# EAGLE design zeta2_v2 (EAGLE 9.0.1)
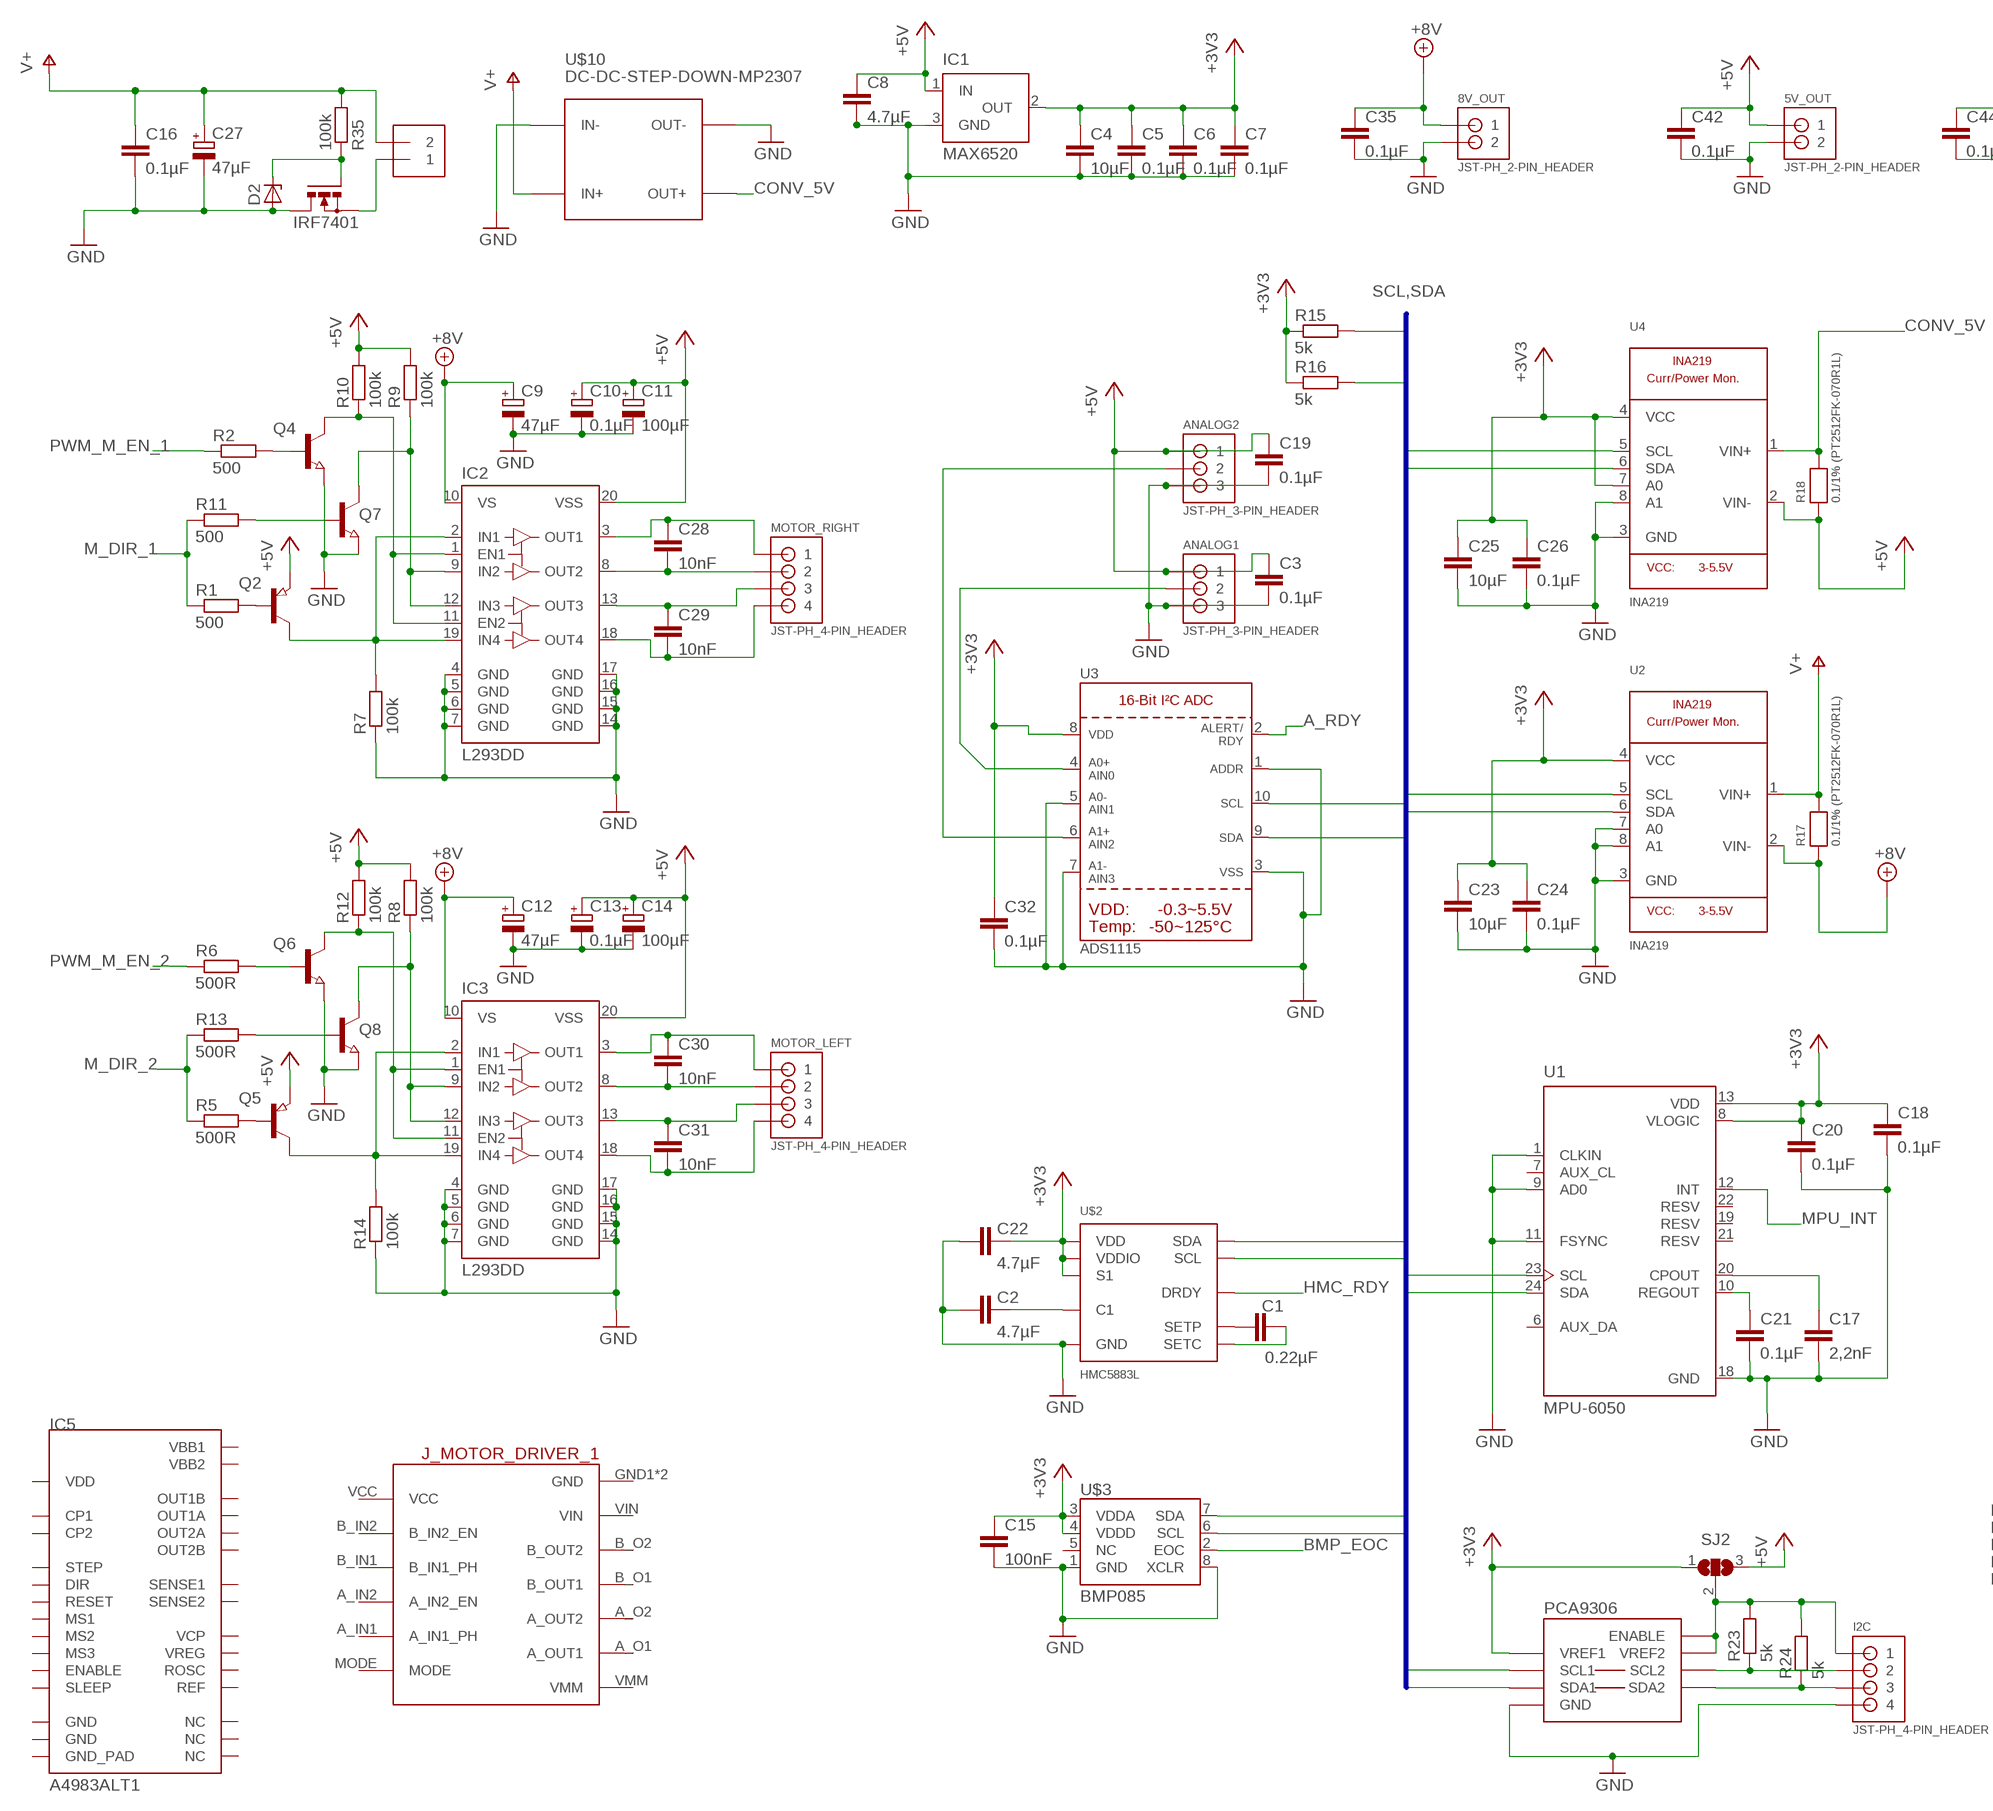
[diagram p0: schematic, sheet 1, part 1 of 2]
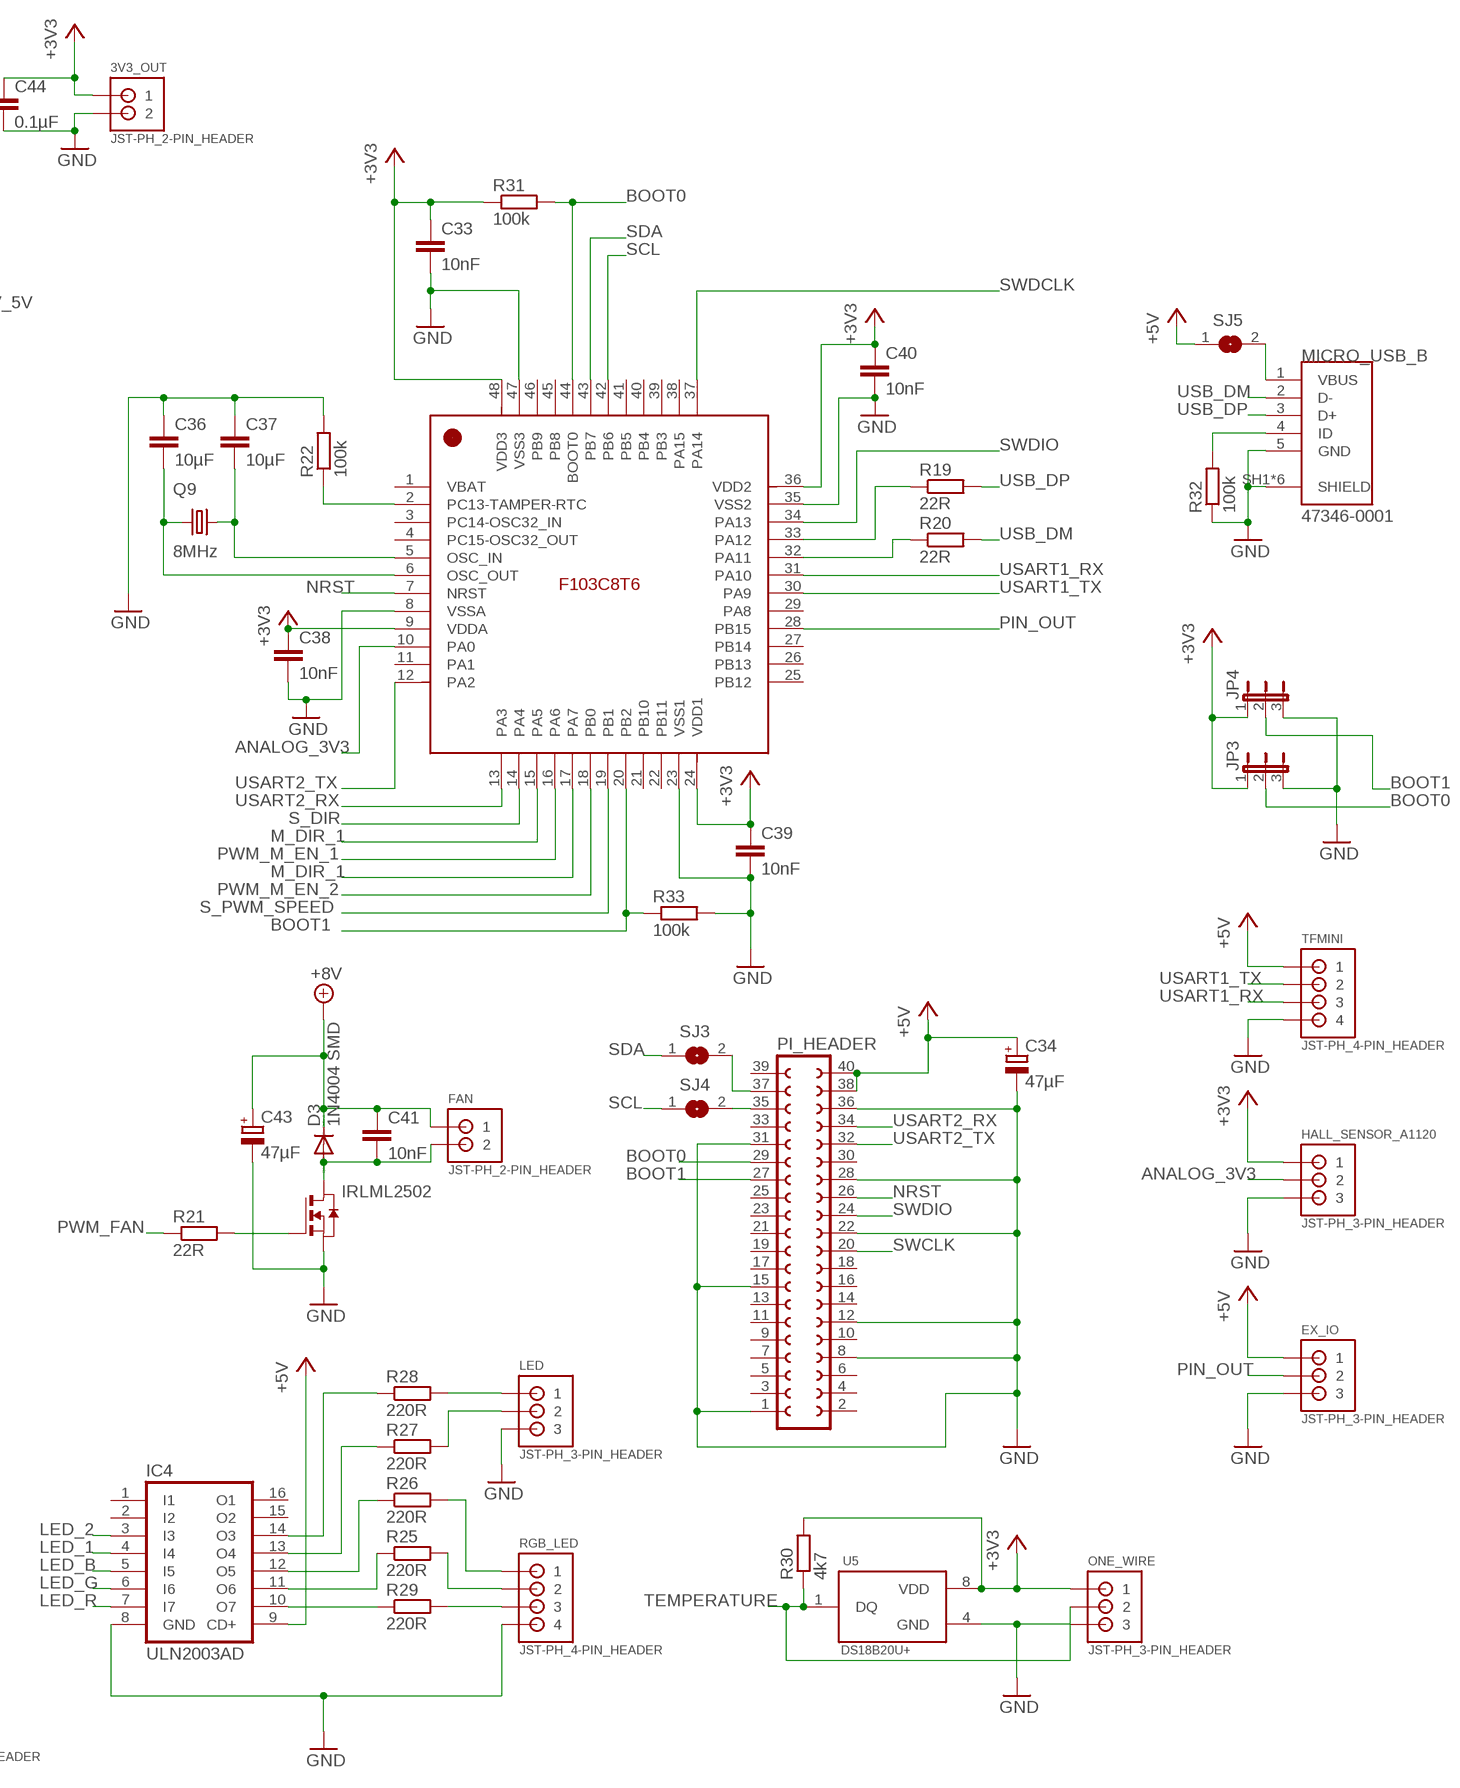
[diagram p1: schematic, sheet 1, part 2 of 2]

## Parts
3V3_OUT  JST-PH_2-PIN_HEADER  [JST_B2B-PH_HEADER]
5V_OUT  JST-PH_2-PIN_HEADER  [JST_B2B-PH_HEADER]
8V_OUT  JST-PH_2-PIN_HEADER  [JST_B2B-PH_HEADER]
ANALOG1  JST-PH_3-PIN_HEADER  [JST_B3B-PH_HEADER]
ANALOG2  JST-PH_3-PIN_HEADER  [JST_B3B-PH_HEADER]
C1  0.22µF  C-EUC0603  [C0603]
C2  4.7µF  C-EUC0603  [C0603]
C3  0.1µF  C-EUC0603  [C0603]
C4  10µF  C-EUC0603  [C0603]
C5  0.1µF  C-EUC0603  [C0603]
C6  0.1µF  C-EUC0603  [C0603]
C7  0.1µF  C-EUC0603  [C0603]
C8  4.7µF  C-EUC0603  [C0603]
C9  47µF  CPOL-EUSMCC  [SMC_C]
C10  0.1µF  CPOL-EUSMCA  [SMC_A]
C11  100µF  CPOL-EUSMCC  [SMC_C]
C12  47µF  CPOL-EUSMCC  [SMC_C]
C13  0.1µF  CPOL-EUSMCA  [SMC_A]
C14  100µF  CPOL-EUSMCC  [SMC_C]
C15  100nF  C-EUC0603  [C0603]
C16  0.1µF  C-EUC0603  [C0603]
C17  2,2nF  C-EUC0603  [C0603]
C18  0.1µF  C-EUC0603  [C0603]
C19  0.1µF  C-EUC0603  [C0603]
C20  0.1µF  C-EUC0603  [C0603]
C21  0.1µF  C-EUC0603  [C0603]
C22  4.7µF  C-EUC0603  [C0603]
C23  10µF  C-EUC0603  [C0603]
C24  0.1µF  C-EUC0603  [C0603]
C25  10µF  C-EUC0603  [C0603]
C26  0.1µF  C-EUC0603  [C0603]
C27  47µF  CPOL-EUSMCC  [SMC_C]
C28  10nF  C-EUC0603  [C0603]
C29  10nF  C-EUC0603  [C0603]
C30  10nF  C-EUC0603  [C0603]
C31  10nF  C-EUC0603  [C0603]
C32  0.1µF  C-EUC0603  [C0603]
C33  10nF  C-EUC0603  [C0603]
C34  47µF  CPOL-EUSMCC  [SMC_C]
C35  0.1µF  C-EUC0603  [C0603]
C36  10µF  C-EUC0603  [C0603]
C37  10µF  C-EUC0603  [C0603]
C38  10nF  C-EUC0603  [C0603]
C39  10nF  C-EUC0603  [C0603]
C40  10nF  C-EUC0603  [C0603]
C41  10nF  C-EUC0603  [C0603]
C42  0.1µF  C-EUC0603  [C0603]
C43  47µF  CPOL-EUSMCC  [SMC_C]
C44  0.1µF  C-EUC0603  [C0603]
D2  ZENER-DIODESOD80C  [SOD80C]
D3  1N4004 SMD  DIODE-MELF-MLL41  [MELF-MLL41]
EX_IO  JST-PH_3-PIN_HEADER  [JST_B3B-PH_HEADER]
FAN  JST-PH_2-PIN_HEADER  [JST_B2B-PH_HEADER]
HALL_SENSOR_A1120  JST-PH_3-PIN_HEADER  [JST_B3B-PH_HEADER]
I2C  JST-PH_4-PIN_HEADER  [JST_B4B-PH_HEADER]
IC1  MAX6520  [SOT23]
IC2  L293DD  [SO20]
IC3  L293DD  [SO20]
IC4  ULN2003AD  [SO16]
IC5  A4983ALT1  [QFN-28-5MM_ALT1]
IRF7401  N-MOSFET-SO8S  [SO-08]
IRLML2502  NMOSSOT23  [SOT-23]
J_MOTOR_DRIVER_1  MOTOR_DRIVER  [MOTOR_DRIVER_FOOTPRINT]
JP3  JP2E  [JP2]
JP4  JP2E  [JP2]
LED  JST-PH_3-PIN_HEADER  [JST_B3B-PH_HEADER]
MICRO_USB_B  47346-0001  [MOLEX_47346-0001]
MOTOR_LEFT  JST-PH_4-PIN_HEADER  [JST_B4B-PH_HEADER]
MOTOR_RIGHT  JST-PH_4-PIN_HEADER  [JST_B4B-PH_HEADER]
ONE_WIRE  JST-PH_3-PIN_HEADER  [JST_B3B-PH_HEADER]
PCA9306  IC2_LEVEL_TRANSLATER  [SOIC-8]
PI_HEADER  FE20-2  [FE20-2]
Q2  PNP-TRANSISTOR_SOT23  [SOT23]
Q4  NPN-TRANSISTOR_SOT23  [SOT23]
Q5  PNP-TRANSISTOR_SOT23  [SOT23]
Q6  NPN-TRANSISTOR_SOT23  [SOT23]
Q7  NPN-TRANSISTOR_SOT23  [SOT23]
Q8  NPN-TRANSISTOR_SOT23  [SOT23]
Q9  8MHz  KX-13  [7.0X5.0]
R1  500  R-EU_R0603  [R0603]
R2  500  R-EU_R0603  [R0603]
R5  500R  R-EU_R0603  [R0603]
R6  500R  R-EU_R0603  [R0603]
R7  100k  R-EU_R0603  [R0603]
R8  100k  R-EU_R0603  [R0603]
R9  100k  R-EU_R0603  [R0603]
R10  100k  R-EU_R0603  [R0603]
R11  500  R-EU_R0603  [R0603]
R12  100k  R-EU_R0603  [R0603]
R13  500R  R-EU_R0603  [R0603]
R14  100k  R-EU_R0603  [R0603]
R15  5k  R-EU_R0603  [R0603]
R16  5k  R-EU_R0603  [R0603]
R17  0.1/1% (PT2512FK-070R1L)  RESISTOR2512  [2512]
R18  0.1/1% (PT2512FK-070R1L)  RESISTOR2512  [2512]
R19  22R  R-EU_R0603  [R0603]
R20  22R  R-EU_R0603  [R0603]
R21  22R  R-EU_R0603  [R0603]
R22  100k  R-EU_R0603  [R0603]
R23  5k  R-EU_R0603  [R0603]
R24  5k  R-EU_R0603  [R0603]
R25  220R  R-EU_R0603  [R0603]
R26  220R  R-EU_R0603  [R0603]
R27  220R  R-EU_R0603  [R0603]
R28  220R  R-EU_R0603  [R0603]
R29  220R  R-EU_R0603  [R0603]
R30  4k7  R-EU_R0603  [R0603]
R31  100k  R-EU_R0603  [R0603]
R32  100k  R-EU_R0603  [R0603]
R33  100k  R-EU_R0603  [R0603]
R35  100k  R-EU_R0603  [R0603]
RGB_LED  JST-PH_4-PIN_HEADER  [JST_B4B-PH_HEADER]
SJ2  SJ2W  [SJ_2]
SJ3  SOLDERJUMPERREFLOW_NOPASTE  [SOLDERJUMPER_REFLOW_NOPASTE]
SJ4  SOLDERJUMPERREFLOW_NOPASTE  [SOLDERJUMPER_REFLOW_NOPASTE]
SJ5  SOLDERJUMPERREFLOW_NOPASTE  [SOLDERJUMPER_REFLOW_NOPASTE]
SUPPLY_IN  TERMBLOCK_1X2-3.5MM  [1X2-3.5MM]
TFMINI  JST-PH_4-PIN_HEADER  [JST_B4B-PH_HEADER]
U1  MPU-6050  [QFN50P400X400X95-24N]
U2  INA219  [SOT23-8]
U3  ADS1115  [MSOP10]
U4  INA219  [SOT23-8]
U5  DS18B20U+  [SOP65P490X95-8N]
U$1  STM32F103C8T6  [LQFP48_7X7MM_0.5MMPP]
U$2  HMC5883L  [LPCC-16]
U$3  BMP085  [BMP085]
U$10  DC-DC-STEP-DOWN-MP2307  [DC-DC-STEP-DOWN-MP2307]

## Nets
+3V3: 3V3_OUT.P1 C4.1 C5.1 C6.1 C7.1 C15.1 C18.1 C20.1 C22.1 C23.1 C24.1 C25.1 C26.1 C32.1 C33.1 C38.1 C39.1 C40.1 C44.1 HALL_SENSOR_A1120.P1 IC1.2(OUT) JP3.1 JP4.1 ONE_WIRE.P1 PCA9306.1(VREF1) R15.1 R16.1 R30.2 R31.1 SJ2.1 U1.8(VLOGIC) U1.13(VDD) U2.4(VCC) U3.8(VDD) U4.4(VCC) U4.7(A0) U5.8(VDD) U$1.9(VDDA) U$1.24(VDD1) U$1.36(VDD2) U$1.48(VDD3) U$2.2(VDD) U$2.4(S1) U$2.13(VDDIO) U$3.3(VDDA) U$3.4(VDDD)
+5V: 5V_OUT.P1 ANALOG1.P1 ANALOG2.P1 C3.1 C8.1 C10.+ C11.+ C13.+ C14.+ C19.1 C34.+ C42.1 EX_IO.P1 IC1.1(IN) IC2.20(VSS) IC3.20(VSS) IC4.9(CD+) PI_HEADER.38 PI_HEADER.40 Q2.2(E) Q5.2(E) R8.2 R9.2 R10.2 R12.2 R18.1 SJ2.3 SJ5.1 TFMINI.P1 U4.2(VIN-)
+8V: 8V_OUT.P1 C9.+ C12.+ C35.1 C41.1 C43.+ D3.C FAN.P1 IC2.10(VS) IC3.10(VS) R17.1 U2.2(VIN-)
A_RDY: U3.2(ALERT/RDY)
ANALOG_3V3: HALL_SENSOR_A1120.P2 U$1.10(PA0)
BMP_EOC: U$3.2(EOC)
BOOT0: JP3.2 PI_HEADER.29 R31.2 U$1.44(BOOT0)
BOOT1: JP4.2 PI_HEADER.27 R33.1 U$1.20(PB2)
CONV_5V: R18.2 U4.1(VIN+) U$10.OUT+
GND: 3V3_OUT.P2 5V_OUT.P2 8V_OUT.P2 ANALOG1.P3 ANALOG2.P3 C2.2 C3.2 C4.2 C5.2 C6.2 C7.2 C8.2 C9.- C10.- C11.- C12.- C13.- C14.- C15.2 C16.2 C17.2 C18.2 C19.2 C20.2 C21.2 C22.2 C23.2 C24.2 C25.2 C26.2 C27.- C32.2 C33.2 C34.- C35.2 C36.1 C37.1 C38.2 C39.2 C40.2 C42.2 C43.- C44.2 D2.A EX_IO.P3 HALL_SENSOR_A1120.P3 I2C.P4 IC1.3(GND) IC2.4(GND) IC2.5(GND) IC2.6(GND) IC2.7(GND) IC2.14(GND) IC2.15(GND) IC2.16(GND) IC2.17(GND) IC3.4(GND) IC3.5(GND) IC3.6(GND) IC3.7(GND) IC3.14(GND) IC3.15(GND) IC3.16(GND) IC3.17(GND) IC4.8(GND) IRF7401.5(D) IRF7401.6(D) IRF7401.7(D) IRF7401.8(D) IRLML2502.2(S) JP3.3 JP4.3 LED.P3 MICRO_USB_B.5(GND) MICRO_USB_B.SH1(SHIELD) MICRO_USB_B.SH2(SHIELD) MICRO_USB_B.SH3(SHIELD) MICRO_USB_B.SH4(SHIELD) MICRO_USB_B.SH5(SHIELD) MICRO_USB_B.SH6(SHIELD) ONE_WIRE.P3 PCA9306.4(GND) PI_HEADER.1 PI_HEADER.8 PI_HEADER.12 PI_HEADER.15 PI_HEADER.22 PI_HEADER.28 PI_HEADER.31 PI_HEADER.36 Q4.2(E) Q6.2(E) Q7.2(E) Q8.2(E) R7.1 R14.1 R22.2 R32.1 R33.2 RGB_LED.P4 TFMINI.P4 U1.1(CLKIN) U1.9(AD0) U1.11(FSYNC) U1.18(GND) U2.3(GND) U2.7(A0) U2.8(A1) U3.1(ADDR) U3.3(VSS) U3.5(AIN1) U3.7(AIN3) U4.3(GND) U4.8(A1) U5.4(GND) U$1.8(VSSA) U$1.23(VSS1) U$1.35(VSS2) U$1.47(VSS3) U$2.9(GND) U$2.11(GND) U$3.1(GND) U$3.8(XCLR) U$10.IN- U$10.OUT-
HMC_RDY: U$2.15(DRDY)
LED_1: IC4.4(I4)
LED_2: IC4.3(I3)
LED_B: IC4.5(I5)
LED_G: IC4.6(I6)
LED_R: IC4.7(I7)
M_DIR_1: R1.1 R11.1 U$1.15(PA5) U$1.17(PA7)
M_DIR_2: R5.1 R13.1
MPU_INT: U1.12(INT)
N$1: IC2.9(IN2) IC2.12(IN3) Q7.3(C) R9.1
N$2: C1.2 U$2.12(SETC)
N$3: C1.1 U$2.8(SETP)
N$4: C2.1 U$2.10(C1)
N$5: IC2.2(IN1) IC2.19(IN4) Q2.3(C) R7.2
N$6: IC3.9(IN2) IC3.12(IN3) Q8.3(C) R8.1
N$7: IC3.2(IN1) IC3.19(IN4) Q5.3(C) R14.2
N$8: IC2.1(EN1) IC2.11(EN2) Q4.3(C) R10.1
N$9: IC3.1(EN1) IC3.11(EN2) Q6.3(C) R12.1
N$10: Q2.1(B) R1.2
N$11: Q7.1(B) R11.2
N$12: Q4.1(B) R2.2
N$13: Q5.1(B) R5.2
N$14: Q6.1(B) R6.2
N$15: Q8.1(B) R13.2
N$16: C17.1 U1.20(CPOUT)
N$17: C29.1 IC2.13(OUT3) MOTOR_RIGHT.P3
N$18: C29.2 IC2.18(OUT4) MOTOR_RIGHT.P4
N$19: C21.1 U1.10(REGOUT)
N$20: C28.2 IC2.8(OUT2) MOTOR_RIGHT.P2
N$21: C28.1 IC2.3(OUT1) MOTOR_RIGHT.P1
N$23: C31.1 IC3.13(OUT3) MOTOR_LEFT.P3
N$24: C31.2 IC3.18(OUT4) MOTOR_LEFT.P4
N$25: C30.2 IC3.8(OUT2) MOTOR_LEFT.P2
N$26: C30.1 IC3.3(OUT1) MOTOR_LEFT.P1
N$27: IC4.10(O7) R29.1
N$28: C36.2 Q9.1 U$1.6(OSC_OUT)
N$29: C37.2 Q9.3 U$1.5(OSC_IN)
N$30: IRLML2502.3(G) R21.2
N$31: IC4.11(O6) R25.1
N$32: R20.1 U$1.32(PA11)
N$33: R19.1 U$1.33(PA12)
N$34: R22.1 U$1.2(PC13-TAMPER-RTC)
N$35: PI_HEADER.37 SJ3.2
N$36: PI_HEADER.35 SJ4.2
N$37: IC4.12(O5) R26.1
N$38: I2C.P1 PCA9306.7(VREF2) PCA9306.8(ENABLE) R23.2 R24.2 SJ2.2
N$39: I2C.P2 PCA9306.6(SCL2) R23.1
N$40: I2C.P3 PCA9306.5(SDA2) R24.1
N$41: IC4.13(O4) R27.1
N$42: IC4.14(O3) R28.1
N$43: MICRO_USB_B.4(ID) R32.2
N$44: LED.P1 R28.2
N$45: R29.2 RGB_LED.P3
N$46: R25.2 RGB_LED.P2
N$47: R26.2 RGB_LED.P1
N$48: LED.P2 R27.2
N$49: MICRO_USB_B.1(VBUS) SJ5.2
N$50: ANALOG1.P2 U3.4(AIN0)
N$51: ANALOG2.P2 U3.6(AIN2)
N$55: C41.2 D3.A FAN.P2 IRLML2502.1(D)
N$56: D2.C IRF7401.4(G) R35.1
N$60: IRF7401.1(S) IRF7401.2(S) IRF7401.3(S) SUPPLY_IN.1
NRST: PI_HEADER.26 U$1.7(NRST)
PIN_OUT: EX_IO.P2 U$1.28(PB15)
PWM_FAN: R21.1
PWM_M_EN_1: R2.1 U$1.16(PA6)
PWM_M_EN_2: R6.1 U$1.18(PB0)
S_DIR: U$1.14(PA4)
S_PWM_SPEED: U$1.19(PB1)
SCL: PCA9306.2(SCL1) R15.2 SJ4.1 U1.23(SCL) U2.5(SCL) U3.10(SCL) U4.5(SCL) U$1.42(PB6) U$2.1(SCL) U$3.6(SCL)
SDA: PCA9306.3(SDA1) R16.2 SJ3.1 U1.24(SDA) U2.6(SDA) U3.9(SDA) U4.6(SDA) U$1.43(PB7) U$2.16(SDA) U$3.7(SDA)
SWCLK: PI_HEADER.20
SWDCLK: U$1.37(PA14)
SWDIO: PI_HEADER.24 U$1.34(PA13)
TEMPERATURE: ONE_WIRE.P2 R30.1 U5.1(DQ)
USART1_RX: TFMINI.P3 U$1.31(PA10)
USART1_TX: TFMINI.P2 U$1.30(PA9)
USART2_RX: PI_HEADER.34 U$1.13(PA3)
USART2_TX: PI_HEADER.32 U$1.12(PA2)
USB_DM: MICRO_USB_B.2(D-) R20.2
USB_DP: MICRO_USB_B.3(D+) R19.2
V+: C16.1 C27.+ R17.2 R35.2 SUPPLY_IN.2 U2.1(VIN+) U$10.IN+
Unconnected: IC4.1(I1) IC4.2(I2) IC4.15(O2) IC4.16(O1) IC5.P$1(OUT2B) IC5.P$2(ENABLE) IC5.P$4(CP1) IC5.P$5(CP2) IC5.P$6(VCP) IC5.P$7(NC) IC5.P$8(VREG) IC5.P$9(MS1) IC5.P$10(MS2) IC5.P$11(MS3) IC5.P$12(RESET) IC5.P$13(ROSC) IC5.P$14(SLEEP) IC5.P$16(STEP) IC5.P$17(REF) IC5.P$19(DIR) IC5.P$20(NC) IC5.P$21(OUT1B) IC5.P$22(VBB1) IC5.P$23(SENSE1) IC5.P$24(OUT1A) IC5.P$25(NC) IC5.P$26(OUT2A) IC5.P$27(SENSE2) IC5.P$28(VBB2) J_MOTOR_DRIVER_1.A_IN1(A_IN1_PH) J_MOTOR_DRIVER_1.A_IN2(A_IN2_EN) J_MOTOR_DRIVER_1.A_O1(A_OUT1) J_MOTOR_DRIVER_1.A_O2(A_OUT2) J_MOTOR_DRIVER_1.B_IN1(B_IN1_PH) J_MOTOR_DRIVER_1.B_IN2(B_IN2_EN) J_MOTOR_DRIVER_1.B_O1(B_OUT1) J_MOTOR_DRIVER_1.B_O2(B_OUT2) J_MOTOR_DRIVER_1.GND1(GND) J_MOTOR_DRIVER_1.GND2(GND) J_MOTOR_DRIVER_1.MODE J_MOTOR_DRIVER_1.VCC J_MOTOR_DRIVER_1.VIN J_MOTOR_DRIVER_1.VMM PI_HEADER.2 PI_HEADER.3 PI_HEADER.4 PI_HEADER.5 PI_HEADER.6 PI_HEADER.7 PI_HEADER.9 PI_HEADER.10 PI_HEADER.11 PI_HEADER.13 PI_HEADER.14 PI_HEADER.16 PI_HEADER.17 PI_HEADER.18 PI_HEADER.19 PI_HEADER.21 PI_HEADER.23 PI_HEADER.25 PI_HEADER.30 PI_HEADER.33 PI_HEADER.39 U1.6(AUX_DA) U1.7(AUX_CL) U1.19(RESV) U1.21(RESV) U1.22(RESV) U$1.1(VBAT) U$1.3(PC14-OSC32_IN) U$1.4(PC15-OSC32_OUT) U$1.11(PA1) U$1.21(PB10) U$1.22(PB11) U$1.25(PB12) U$1.26(PB13) U$1.27(PB14) U$1.29(PA8) U$1.38(PA15) U$1.39(PB3) U$1.40(PB4) U$1.41(PB5) U$1.45(PB8) U$1.46(PB9) U$3.5(NC)

## Buses
SCL,SDA

## Power pins joined to a net without a drawn wire
GND: IC5.P$3(GND) IC5.P$18(GND)
GND_PAD: IC5.P$29(GND_PAD)
VDD: IC5.P$15(VDD)

## Library data of the parts
3V3_OUT 5V_OUT 8V_OUT FAN = srg:JST-PH_2-PIN_HEADER: 2-pin JST PH Shrouded Header, top entry P/N B2B-PH-K-S Mating connector PHR-2 Mating cable assembly: Sparkfun PRT-09914 <http://www.sparkfun.com/products/9914>
ANALOG1 ANALOG2 EX_IO HALL_SENSOR_A1120 LED ONE_WIRE = srg:JST-PH_3-PIN_HEADER: 3-pin JST PH Shrouded Header, top entry P/N B3B-PH-K-S Mating connector PHR-3
C1-C8 C15-C26 C28-C33 C35-C42 C44 = rcl:C-EU: CAPACITOR, European symbol; SPICEPREFIX: C
C9-C14 C27 C34 C43 = rcl:CPOL-EU: POLARIZED CAPACITOR, European symbol; SPICEPREFIX: C
D2 = diode:ZENER-DIODE: Z-Diode
D3 = diode:DIODE-: DIODE
I2C MOTOR_LEFT MOTOR_RIGHT RGB_LED TFMINI = srg:JST-PH_4-PIN_HEADER: 4-pin JST PH Shrouded Header, top entry P/N B4B-PH-K-S Mating connector PHR-4 Mating cable assembly: Sparkfun PRT-09916 <http://www.sparkfun.com/products/9916>
IC1 = maxim:MAX6520: 1.2V Voltage Reference 50ppm/°C, SOT23, 3-Terminal Source: Data sheet <http://datasheets.maxim-ic.com/en/ds/MAX6520.pdf>; MF: MAXIM; MPN: MAX6520EUR-T; OC_FARNELL: unknown; OC_NEWARK: 02J4586
IC2 IC3 = st-microelectronics:L293DD: PUSH-PULL FOUR CHANNEL DRIVER WITH DIODES Source: http://www.st.com/stonline/books/pdf/docs/1330.pdf; OC_FARNELL: unknown
IC4 = uln-udn:ULN2003A: DRIVER ARRAY
IC5 = Testing:A4983: DMOS Microstepping Driver with Translator
IRF7401 = transistor-power:N-MOSFET-SO8: N-Channel MOSFET Example: FDS7760A; N-Channel Logic Level PowerTrench® MOSFET FDS2572; N-Channel UltraFET® Trench MOSFET Source: www.fairchildsemi.com
IRLML2502 = zetex:NMOSSOT23: MOS FET; OC_FARNELL: unknown; OC_NEWARK: unknown
J_MOTOR_DRIVER_1 = Pololu Encoder and Motor Driver:MOTOR_DRIVER: DRV8835 Dual Motor Driver Carrier
JP3 JP4 = jumper:JP2E: JUMPER
MICRO_USB_B = 47346-0001:47346-0001: CONN RCPT 5POS MICRO USB R/A SMD; AVAILABILITY: Good; DESCRIPTION: Micro-USB B Receptacle with Flange, Bottom Mount, SMT, Lead-Free; MF: Molex; MP: 47346-0001; PACKAGE: None; PRICE: 0.70 USD
PCA9306 = srg:IC2_LEVEL_TRANSLATER: I2C Level Translator PCA9306 Data Sheet <http://www.ti.com/lit/ds/symlink/pca9306.pdf> Sparkfun breakout board schematic <http://dlnmh9ip6v2uc.cloudfront.net/datasheets/BreakoutBoards/PCA9306_Breakout.pdf>
PI_HEADER = con-lsta:FE20-2: FEMALE HEADER; OC_FARNELL: unknown; OC_NEWARK: unknown
Q2 Q5 = semicon-smd-ipc:PNP-TRANSISTOR_: PNP TRANSISTOR
Q4 Q6-Q8 = semicon-smd-ipc:NPN-TRANSISTOR_: NPN TRANSISTOR
Q9 = crystal-geyer_V1_0:KX: Quartz Crystals (MHz) SMD: KX - Serie Model Size l/w/h [mm] Frequency Range Frequency Stability Temp. Range [°C] Load Capacitance AECQ 200 availabel Datasheet KX-4 KX-5 KX-6 KX-7 KX-9A KX-9B KX-12A KX-12B KX-13 KX-20 KX-K KX-KS 1.6/1.2/0.3 2.0/1.6/0.45 2.5/2.0/0.55 3.2/2.5/0.8 5.0/3.2/1.0 5.0/3.2/1.1 6.0/3.5/1.1 6.0/3.5/1.0 7.0/5.0 /1.3 11.6/5.5/1.6 12.3/4.5/4.2 12.3/4.5/3.2 24.0 ~ 80.0 MHz 16.0 ~ 80.0 MHz 12.0 ~ 80.0 MHz 8.0 ~ 60.0 MHz 7,68 ~ 300,0 MHz 8,0 ~ 50,0 MHz 8,0 ~ 150,0 MHz 8,0 ~ 50,0 MHz 6,0 ~ 160,0 MHz 3,579 ~ 25,0 MHz 3,579 ~ 70,0 MHz 3,579 ~ 70,0 MHz ±10 … ±50ppm ±10 … ±50ppm ±10 … ±50ppm ±10 … ±50ppm ±10 … ±50ppm ±10 … ±50ppm ±10 … ±50ppm ±10 … ±50ppm ±10 … ±50ppm ±50ppm ±10 … ±50ppm ±10 … ±50ppm (*) -40°C …+85°C (*) -40°C …+125°C (*) -40°C …+125°C (*) -40°C …+125°C (*) -40°C …+105°C (*) -40°C …+105°C (*) -40°C …+125°C (*) -40°C …+105°C (*) -40°C …+105°C (*) -40°C …+105°C (*) -40°C …+85°C (*) -40°C …+85°C 8, 8…16 8, 8…16 10, 8…16 12, 7…20 16, 10…20 16, 10…20 16, 10…20 16, 12…20 16, 12…20 16, 12…20 16, 12…30 16, 12…30 - yes yes yes - - - - - - - - KX-4.pdf <http://www.geyer-electronic.de/uploads/tx_userartikelfrequenz/GEYER-KX-4.pdf> KX-5.pdf <http://www.geyer-electronic.de/uploads/tx_userartikelfrequenz/GEYER-KX-5.pdf> KX-6.pdf <http://www.geyer-electronic.de/uploads/tx_userartikelfrequenz/GEYER-KX-6.pdf> KX-7.pdf <http://www.geyer-electronic.de/uploads/tx_userartikelfrequenz/GEYER-KX-7.pdf> KX-9A.pdf <http://www.geyer-electronic.de/uploads/tx_userartikelfrequenz/GEYER-KX-9A.pdf> KX-9B.pdf <http://www.geyer-electronic.de/uploads/tx_userartikelfrequenz/GEYER-KX-9B.pdf> KX-12A.pdf <http://www.geyer-electronic.de/uploads/tx_userartikelfrequenz/GEYER-KX-12A.pdf> KX-12B.pdf <http://www.geyer-electronic.de/uploads/tx_userartikelfrequenz/GEYER-KX-12B.pdf> KX-13.pdf <http://www.geyer-electronic.de/uploads/tx_userartikelfrequenz/GEYER-KX-13.pdf> KX-20.pdf <http://www.geyer-electronic.de/uploads/tx_userartikelfrequenz/GEYER-KX-20.pdf> KX-K.pdf <http://www.geyer-electronic.de/uploads/tx_userartikelfrequenz/GEYER-KX-K.pdf> KX-KS.pdf <http://www.geyer-electronic.de/uploads/tx_userartikelfrequenz/GEYER-KX-KS.pdf> <http://www.geyer-electronic.de/fileadmin/template/img/logo-geyer-electronic.png> Details see: http://www.geyer-electronic.de/Frequenz-Produkte.9.0.html Created 2016-06-07, Hans Locher 2016 (C) Geyer Quartz Technology KX4,KX5,KX6,KX7,KX9A,KX9B,KX12A,KX12B,KX13,KX20,KXK,KXKS;1612;2016;2520;3225;5032;6035;7050;11655;12345;1,6x1,2;2,0x1,6;2,5x2,0;3,2x2,5;5,0x3,2;6,0x3,5;7,0x5,0;11,6x5,5;12,3x4,5;12,3x4,5;1.6x1.2;2.0x1.6;2.5x2.0;3.2x2.5;5.0x3.2;6.0x3.5;7.0x5.0;11.6x5.5;12.3x4.5;12.3x4.5;
R1 R2 R5-R16 R19-R33 R35 = rcl:R-EU_: RESISTOR, European symbol; SPICEPREFIX: R
R17 R18 = microbuilder:RESISTOR: Resistors 0402 - 0402 Surface Mount Package 22 Ohm 1% 1/16W [Digikey: 311-22.0LRTR-ND] 33 Ohm 5% 1/16W 1.0K 5% 1/16W 1.5K 5% 1/16W 2.0K 1% 1/16W 10.0K 1% 1/16W [Digikey: 311-10.0KLRTR-ND] 10.0K 5% 1/16W [Digikey: RMCF0402JT10K0TR-ND] 12.1K 1% 1/16W [Digikey: 311-22.0LRTR-ND] 100.0K 5% 1/16W 0603 - 0603 Surface Mount Package 0 Ohm 1/10 Watt 1% Resistor 15 Ohm 1/10 Watt 1% Resistor 33 Ohm 1/10 Watt 1% Resistor 49.9 Ohm 1/10 Watt 1% Resistor 100 Ohm 1/10 Watt 1% Resistor 150 Ohm 1/10 Watt 1% Resistor 240 Ohm 1/10 Watt 1% Resistor 390 Ohm 1/10 Watt 1% Resistor 560 Ohm 1/10 Watt 1% Resistor 680 Ohm 1/10 Watt 1% Resistor 750 Ohm 1/10 Watt 1% Resistor 1.0K Ohm 1/10 Watt 1% Resistor 1.5K Ohm 1/10 Watt 1% Resistor 2.0K Ohm 1/10 Watt 1% Resistor 2.2K Ohm 1/10 Watt 1% Resistor 3.3K Ohm 1/10 Watt 1% Resistor 4.7K Ohm 1/10 Watt 1% Resistor 10.0K Ohm 1/10 Watt 1% Resistor 12.0K Ohm 1/10 Watt 1% Resistor 12.1K Ohm 1/10 Watt 1% Resistor 20.0K Ohm 1/10 Watt 1% Resistor 33.0K Ohm 1/10 Watt 1% Resistor 100.0K Ohm 1/10 Watt 1% Resistor 0805 - 0805 Surface Mount Package 0 Ohm 1/8 Watt 1% Resistor 33 Ohm 1/8 Watt 1% Resistor 100 Ohm 1/8 Watt 1% Resistor 150 Ohm 1/8 Watt 1% Resistor 200 Ohm 1/8 Watt 1% Resistor 240 Ohm 1/8 Watt 1% Resistor 330 Ohm 1/8 Watt 1% Resistor 390 Ohm 1/8 Watt 1% Resistor 470 Ohm 1/8 Watt 1% Resistor 1.0K Ohm 1/8 Watt 1% Resistor 1.5K Ohm 1/8 Watt 1% Resistor 2.0K Ohm 1/8 Watt 1% Resistor 4.7K Ohm 1/8 Watt 1% Resistor 5.1K Ohm 1/8 Watt 1% Resistor 5.6K Ohm 1/8 Watt 1% Resistor 10.0K Ohm 1/8 Watt 1% Resistor 22.0K Ohm 1/8 Watt 1% Resistor 33.0K Ohm 1/8 Watt 1% Resistor 100K Ohm 1/8 Watt 1% Resistor 1206 - 1206 Surface Mount Package 2012 - 2010 Surface Mount Package 0.11 Ohm 1/2 Watt 1% Resistor - Digikey: RHM.11UCT-ND
SJ2 = jumper:SJ2W: SMD solder JUMPER
SJ3-SJ5 = microbuilder:SOLDERJUMPER: SMD Solder JUMPER Solder the two pads together to create a connection, or remove the solder to break it. REFLOW - Use this footprint for solder paste and reflow ovens. WAVE - Use this footprint for hand-soldering (larger pads). CLOSED - Has a trace between the two pads to ensure it is closed by default. The trace needs to be cut to disable the jumper, and can be closed again by creating a solder bridge between the two pads.
SUPPLY_IN = microbuilder:TERMBLOCK_1X2: 3.5mm Terminal block http://www.ladyada.net/library/pcb/eaglelibrary.html
U1 = MPU-6050:MPU-6050: MPU-6050 Six-Axis (Gyro + Accelerometer) MEMS MotionTracking™ Devices; AVAILABILITY: Good; DESCRIPTION: 3-axis gyroscope, 3-axis accelerometer in a 4x4x0.9 housing; MF: TDK; MP: MPU-6050; PACKAGE: QFN-24 InvenSense; PRICE: 5.12 USD
U2 U4 = INA219:INA219: INA219 - I2C Current/Power Monitor Voltage Range: 0-26V Accuracy: 0.5% Temperature: -40°C - 125°C; AVAILABILITY: Unavailable; DESCRIPTION: the ina219 is a high-side current shunt and power monitor with an i2c interface. the ina219 monitors both shunt drop ...; MF: Texas Instruments; MP: INA219; PACKAGE: None; PRICE: None
U3 = ADS1115:ADS1115: 16-Bit Del-Sig ADC Four single-ended inputs or two differential inputs Internal PGA I2C interface 2.0-5.5V; AVAILABILITY: Unavailable; DESCRIPTION: 16-Bit ADC with Integrated MUX PGA Comparator Oscillator and Reference; MF: Texas Instruments; MP: ADS1115; PACKAGE: XFQFN-10 Texas Instruments; PRICE: None
U5 = DS18B20U_:DS18B20U+: Board Mount Temperature Sensors Prgmble Resolution 1-Wire Parasite Pwr; AVAILABILITY: Unavailable; DESCRIPTION: Date Code: 1043+; RoHS Compliant: Yes;; MF: Maxim; MP: DS18B20U+; PACKAGE: TSSOP-8 Chip Coolers; PRICE: None
U$1 = STM32F103C8T6:STM32F103C8T6; AVAILABILITY: Good; DESCRIPTION: Mainstream Performance line, ARM Cortex-M3 MCU with 64 Kbytes Flash, 72 MHz CPU, motor control, USB and CAN; MF: STMicroelectronics; MP: STM32F103C8T6; PACKAGE: LQFP-48 STMicroelectronics; PRICE: 3.83 USD
U$2 = HMC5883L:HMC5883L; AVAILABILITY: Unavailable; DESCRIPTION: Digital Compass +/- 0.8g, Lcc-16; MF: Honeywell; MP: HMC5883L-T; PACKAGE: LCC-16 Honeywell; PRICE: None
U$3 = BMP085:BMP085: BMP085 Pressure Sensor Great little MEMS pressure sensor. SKU: COM-09603; AVAILABILITY: Unavailable; MF: Bosch Sensortec; MP: BMP085; PACKAGE: CLCC-8 Bosch Sensortec; PRICE: None
U$10 = diy-modules:DC-DC-STEP-DOWN-MP2307: DC/DC Step-Down Regulator based on MP2307DN chip MP2307 datasheet available here: https://cdn-shop.adafruit.com/datasheets/MP2307_r1.9.pdf Click here to find device on ebay.com <http://www.ebay.com/sch/dc+dc+3a+mini+converter>

## Board
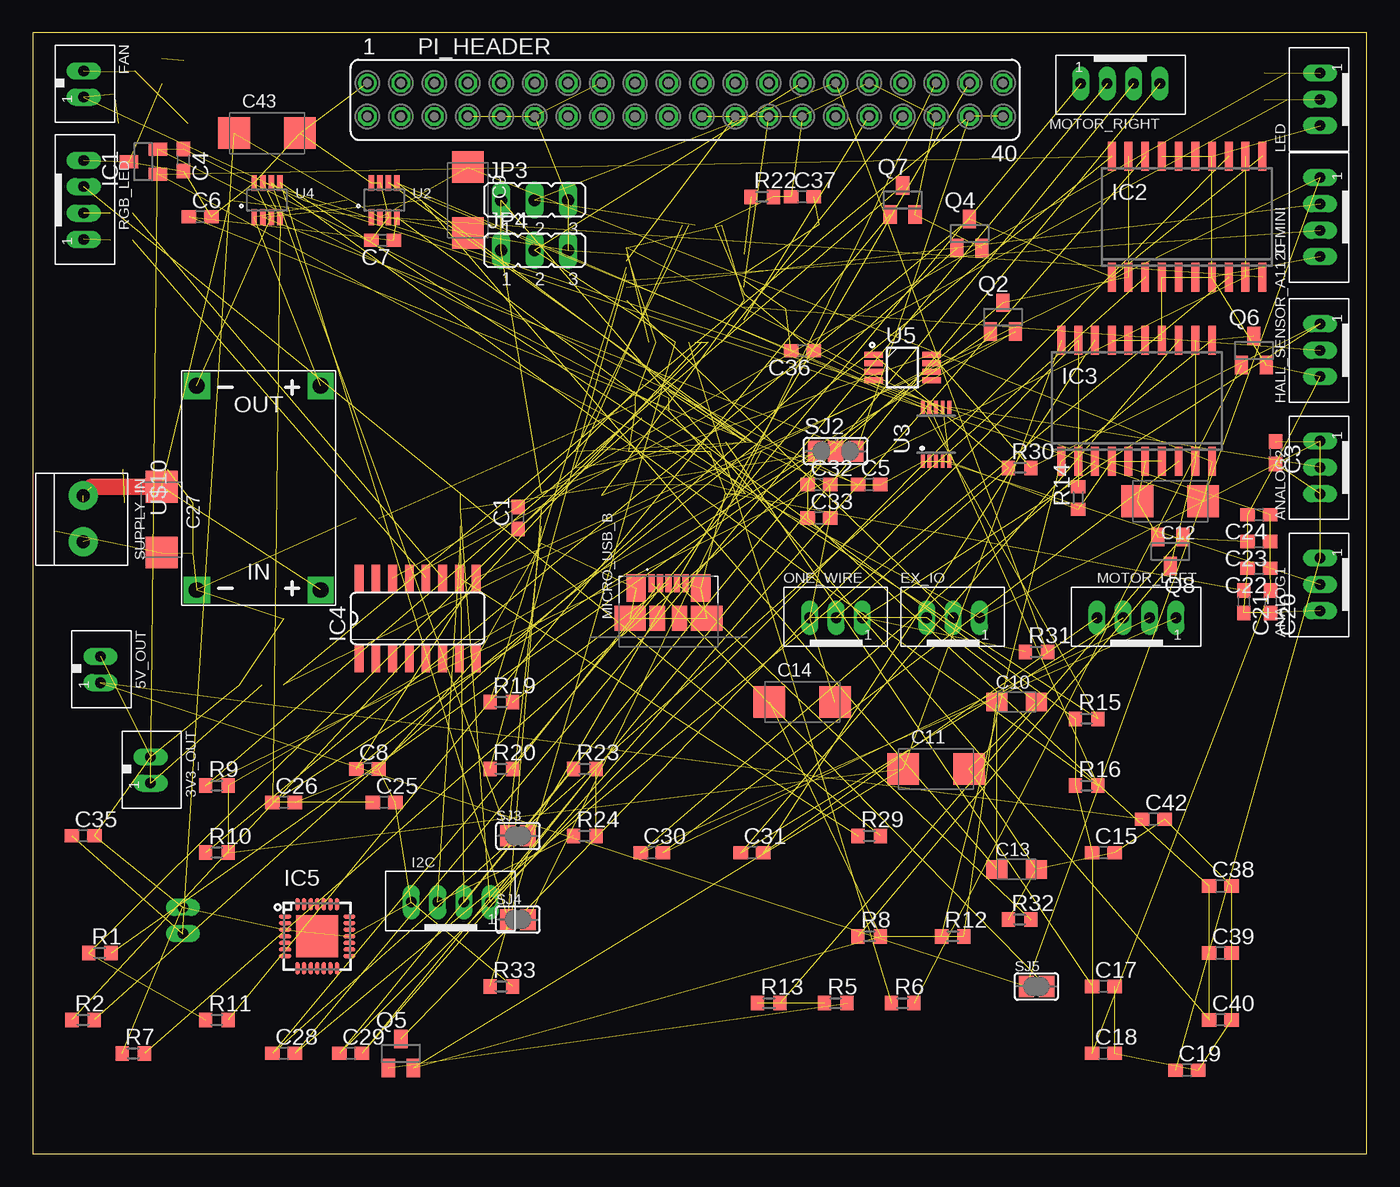
[diagram p2: board, top side]
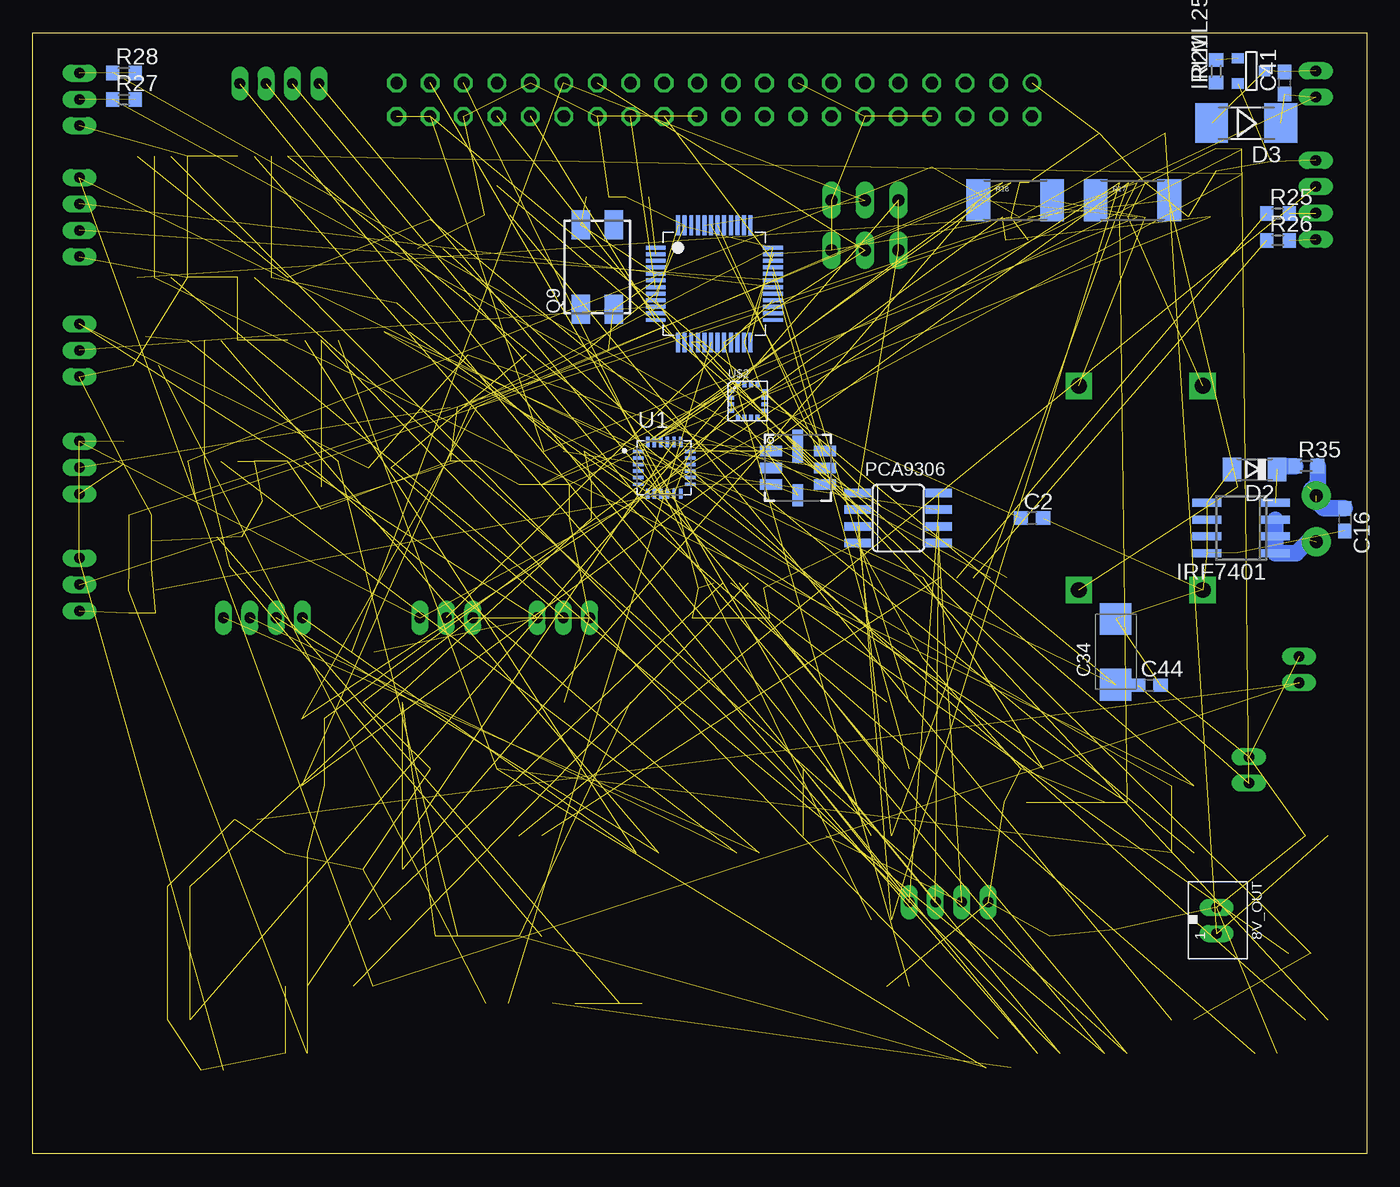
[diagram p3: board, bottom side, seen from below]

Size 101.27 x 85.08 mm. Coordinates in mm from the lower left corner, seen from the top.
Outline: 0,0 101.27,0 101.27,85.08 0,85.08 0,0
Copper layers (1*16): Top 0.035mm / dielectric 1.5mm / Bottom 0.035mm
Design rules "default": minimum track width 6mil, minimum drill 0.35mm, track to track 6mil, track to pad 6mil, pad to pad 6mil, via to via 6mil, smd to smd 6mil, copper to edge 40mil, drill to drill 6mil, minimum pad ring 10mil, minimum via ring 8mil, stop-mask expansion 4mil, vias tented up to drill 0mil, thermal gap 10mil

### Footprints (pad centres in the part's own frame; a part is rotated, then mirrored left to right if it is on the bottom)
JST_B2B-PH_HEADER = drill 0.8 long: P1 1.075,0.048; P2 -0.925,0.048
JST_B3B-PH_HEADER = drill 0.8 long: P1 2.027,0.048; P2 0.028,0.048; P3 -1.972,0.048
C0603 = smd 1.1 x 1: 1 -0.85,0; 2 0.85,0
SMC_C = smd 2.4 x 2.4: + -2.5,0; - 2.5,0
SMC_A = smd 1.6 x 1.4: + -1.5,0; - 1.5,0
SOD80C = smd 1.4 x 1.8: A 1.7,0; C -1.7,0
MELF-MLL41 = smd 2.5 x 3: A 2.625,0; C -2.625,0
JST_B4B-PH_HEADER = drill 0.8 long: P1 2.98,0.048; P2 0.98,0.048; P3 -1.02,0.048; P4 -3.02,0.048
SOT23 = smd 1 x 1.4: 1 -0.95,-1.1; 2 0.95,-1.1; 3 0,1.1
SO20 = smd 0.6 x 2.2: 1 -5.715,-4.6; 2 -4.445,-4.6; 3 -3.175,-4.6; 4 -1.905,-4.6; 5 -0.635,-4.6; 6 0.635,-4.6; 7 1.905,-4.6; 8 3.175,-4.6; 9 4.445,-4.6; 10 5.715,-4.6; 11 5.715,4.6; 12 4.445,4.6; 13 3.175,4.6; 14 1.905,4.6; 15 0.635,4.6; 16 -0.635,4.6; 17 -1.905,4.6; 18 -3.175,4.6; 19 -4.445,4.6; 20 -5.715,4.6
SO16 = smd 0.66 x 2.032: 1 -4.445,-3.073; 2 -3.175,-3.073; 3 -1.905,-3.073; 4 -0.635,-3.073; 5 0.635,-3.073; 6 1.905,-3.073; 7 3.175,-3.073; 8 4.445,-3.073; 9 4.445,3.073; 10 3.175,3.073; 11 1.905,3.073; 12 0.635,3.073; 13 -0.635,3.073; 14 -1.905,3.073; 15 -3.175,3.073; 16 -4.445,3.073
QFN-28-5MM_ALT1 = smd 0.94 x 0.3: P$1 -2.44,1.5; P$2 -2.44,1; P$3 -2.44,0.5; P$4 -2.44,0; P$5 -2.44,-0.5; P$6 -2.44,-1; P$7 -2.44,-1.5; P$15 2.44,-1.5; P$16 2.44,-1; P$17 2.44,-0.5; P$18 2.44,0; P$19 2.44,0.5; P$20 2.44,1; P$21 2.44,1.5 | smd 0.3 x 0.94: P$8 -1.5,-2.44; P$9 -1,-2.44; P$10 -0.5,-2.44; P$11 0,-2.44; P$12 0.5,-2.44; P$13 1,-2.44; P$14 1.5,-2.44; P$22 1.5,2.44; P$23 1,2.44; P$24 0.5,2.44; P$25 0,2.44; P$26 -0.5,2.44; P$27 -1,2.44; P$28 -1.5,2.44 | smd 3.175 x 3.175: P$29 0,0
SO-08 = smd 0.6 x 2.2: 1 -1.905,-2.6; 2 -0.635,-2.6; 3 0.635,-2.6; 4 1.905,-2.6; 5 1.905,2.6; 6 0.635,2.6; 7 -0.635,2.6; 8 -1.905,2.6
SOT-23 = smd 0.787 x 0.889: 1 0.025,-1.016; 2 -0.94,1.016; 3 0.991,1.016
MOTOR_DRIVER_FOOTPRINT = drill 0.9 pad 1.778: A_IN1 3.81,-5.08; A_IN2 3.81,-2.54; A_O1 -3.81,-5.08; A_O2 -3.81,-2.54; B_IN1 3.81,0; B_IN2 3.81,2.54; B_O1 -3.81,0; B_O2 -3.81,2.54; GND2 3.81,7.62; MODE 3.81,-7.62; VCC 3.81,5.08; VIN -3.81,5.08; VMM -3.81,-7.62 | drill 0.9 pad 1.778 square: GND1 -3.81,7.62
JP2 = drill 0.914 long: 1 -2.54,0; 2 0,0; 3 2.54,0
MOLEX_47346-0001 = smd 0.45 x 1.38: 1 -1.3,2.66; 2 -0.65,2.66; 3 0,2.66; 4 0.65,2.66; 5 1.3,2.66 | smd 1.475 x 2.1: SH1 -2.462,2.3; SH2 2.462,2.3 | smd 2.375 x 1.9: SH3 -2.913,0; SH6 2.913,0 | smd 1.175 x 1.9: SH4 -0.838,0; SH5 0.838,0
SOIC-8 = smd 0.66 x 2.032: 1 -1.905,-3.073; 2 -0.635,-3.073; 3 0.635,-3.073; 4 1.905,-3.073; 5 1.905,3.073; 6 0.635,3.073; 7 -0.635,3.073; 8 -1.905,3.073
FE20-2 = drill 0.914: 1 -24.13,1.27 | drill 0.914 octagon: 2 -24.13,-1.27; 3 -21.59,1.27; 4 -21.59,-1.27; 5 -19.05,1.27; 6 -19.05,-1.27; 7 -16.51,1.27; 8 -16.51,-1.27; 9 -13.97,1.27; 10 -13.97,-1.27; 11 -11.43,1.27; 12 -11.43,-1.27; 13 -8.89,1.27; 14 -8.89,-1.27; 15 -6.35,1.27; 16 -6.35,-1.27; 17 -3.81,1.27; 18 -3.81,-1.27; 19 -1.27,1.27; 20 -1.27,-1.27; 21 1.27,1.27; 22 1.27,-1.27; 23 3.81,1.27; 24 3.81,-1.27; 25 6.35,1.27; 26 6.35,-1.27; 27 8.89,1.27; 28 8.89,-1.27; 29 11.43,1.27; 30 11.43,-1.27; 31 13.97,1.27; 32 13.97,-1.27; 33 16.51,1.27; 34 16.51,-1.27; 35 19.05,1.27; 36 19.05,-1.27; 37 21.59,1.27; 38 21.59,-1.27; 39 24.13,1.27; 40 24.13,-1.27
7.0X5.0 = smd 2.2 x 1.4: 1 -3.2,-1.25; 2 3.2,-1.25; 3 3.2,1.25; 4 -3.2,1.25
R0603 = smd 1 x 1.1: 1 -0.85,0; 2 0.85,0
2512 = smd 1.8 x 3.2: 1 -2.8,0; 2 2.8,0
SJ_2 = smd 1.168 x 1.6: 1 -1.524,0; 2 0,0; 3 1.524,0
SOLDERJUMPER_REFLOW_NOPASTE = smd 1.168 x 1.6: 1 -0.762,0; 2 0.762,0
1X2-3.5MM = drill 1 pad 2.184: 1 1.8,0; 2 -1.7,0
QFN50P400X400X95-24N = smd 0.79 x 0.26: 1 -1.97,1.25; 2 -1.97,0.75; 3 -1.97,0.25; 4 -1.97,-0.25; 5 -1.97,-0.75; 6 -1.97,-1.25; 13 1.97,-1.25; 14 1.97,-0.75; 15 1.97,-0.25; 16 1.97,0.25; 17 1.97,0.75; 18 1.97,1.25 | smd 0.26 x 0.79: 7 -1.25,-1.97; 8 -0.75,-1.97; 9 -0.25,-1.97; 10 0.25,-1.97; 11 0.75,-1.97; 12 1.25,-1.97; 19 1.25,1.97; 20 0.75,1.97; 21 0.25,1.97; 22 -0.25,1.97; 23 -0.75,1.97; 24 -1.25,1.97
SOT23-8 = smd 0.4 x 1.2: 1 -0.975,-1.3; 2 -0.325,-1.3; 3 0.325,-1.3; 4 0.975,-1.3; 5 0.975,1.3; 6 0.325,1.3; 7 -0.325,1.3; 8 -0.975,1.3
MSOP10 = smd 0.3 x 1: 1 -1,-2.05; 2 -0.5,-2.05; 3 0,-2.05; 4 0.5,-2.05; 5 1,-2.05; 6 1,2.05; 7 0.5,2.05; 8 0,2.05; 9 -0.5,2.05; 10 -1,2.05
SOP65P490X95-8N = smd 1.4 x 0.45: 1 -2.2,0.975; 2 -2.2,0.325; 3 -2.2,-0.325; 4 -2.2,-0.975; 5 2.2,-0.975; 6 2.2,-0.325; 7 2.2,0.325; 8 2.2,0.975
LQFP48_7X7MM_0.5MMPP = smd 1.5 x 0.3: 1 -4.45,2.75; 2 -4.45,2.25; 3 -4.45,1.75; 4 -4.45,1.25; 5 -4.45,0.75; 6 -4.45,0.25; 7 -4.45,-0.25; 8 -4.45,-0.75; 9 -4.45,-1.25; 10 -4.45,-1.75; 11 -4.45,-2.25; 12 -4.45,-2.75; 25 4.45,-2.75; 26 4.45,-2.25; 27 4.45,-1.75; 28 4.45,-1.25; 29 4.45,-0.75; 30 4.45,-0.25; 31 4.45,0.25; 32 4.45,0.75; 33 4.45,1.25; 34 4.45,1.75; 35 4.45,2.25; 36 4.45,2.75 | smd 0.3 x 1.5: 13 -2.75,-4.45; 14 -2.25,-4.45; 15 -1.75,-4.45; 16 -1.25,-4.45; 17 -0.75,-4.45; 18 -0.25,-4.45; 19 0.25,-4.45; 20 0.75,-4.45; 21 1.25,-4.45; 22 1.75,-4.45; 23 2.25,-4.45; 24 2.75,-4.45; 37 2.75,4.45; 38 2.25,4.45; 39 1.75,4.45; 40 1.25,4.45; 41 0.75,4.45; 42 0.25,4.45; 43 -0.25,4.45; 44 -0.75,4.45; 45 -1.25,4.45; 46 -1.75,4.45; 47 -2.25,4.45; 48 -2.75,4.45
LPCC-16 = smd 0.45 x 0.3: 1 -1.275,0.75; 2 -1.275,0.25; 3 -1.275,-0.25; 4 -1.275,-0.75; 9 1.275,-0.75; 10 1.275,-0.25; 11 1.275,0.25; 12 1.275,0.75 | smd 0.3 x 0.45: 5 -0.75,-1.275; 6 -0.25,-1.275; 7 0.25,-1.275; 8 0.75,-1.275; 13 0.75,1.275; 14 0.25,1.275; 15 -0.25,1.275; 16 -0.75,1.275
BMP085 = smd 1.67 x 0.8: 1 -2.065,1.27; 2 -2.065,0; 3 -2.065,-1.27; 5 2.065,-1.27; 6 2.065,0; 7 2.065,1.27 | smd 0.8 x 1.67: 4 0,-2.065 | smd 0.8 x 2.5: 8 0,1.65
DC-DC-STEP-DOWN-MP2307 = drill 1.2 pad 2 square: IN+ -7.747,-4.699; IN- -7.747,4.699; OUT+ 7.747,-4.699; OUT- 7.747,4.699

### Placement (x,y rotation side)
3V3_OUT  8.89,29.21 270 top
5V_OUT  5.08,36.83 270 top
8V_OUT  11.43,17.78 270 bottom
ANALOG1  97.79,43.18 90 top
ANALOG2  97.79,52.07 90 top
C1  36.83,48.26 90 top
C2  25.4,48.26 0 bottom
C3  94.36,53.21 270 top
C4  11.43,75.44 270 top
C5  63.5,50.8 0 top
C6  12.7,71.12 0 top
C7  26.54,69.34 180 top
C8  25.4,29.21 0 top
C9  33.02,72.39 270 top
C10  74.7,34.29 0 top
C11  68.58,29.21 0 top
C12  86.36,49.53 180 top
C13  74.7,21.59 0 top
C14  58.42,34.29 0 top
C15  81.28,22.86 0 top
C16  1.65,48.13 270 bottom
C17  81.28,12.7 0 top
C18  81.28,7.62 0 top
C19  87.63,6.35 0 top
C20  93.98,41.91 270 top
C21  91.95,41.91 270 top
C22  93.09,44.45 180 top
C23  93.09,46.48 180 top
C24  93.09,48.51 180 top
C25  26.67,26.67 0 top
C26  19.05,26.67 0 top
C27  9.78,48.13 270 top
C28  19.05,7.62 0 top
C29  24.13,7.62 0 top
C30  46.99,22.86 0 top
C31  54.61,22.86 0 top
C32  59.69,50.8 0 top
C33  59.69,48.26 0 top
C34  19.05,38.1 90 bottom
C35  3.81,24.13 0 top
C36  58.42,60.96 180 top
C37  58.42,72.64 0 top
C38  90.17,20.32 0 top
C39  90.17,15.24 0 top
C40  90.17,10.16 0 top
C41  6.22,81.28 90 bottom
C42  85.09,25.4 0 top
C43  17.78,77.47 0 top
C44  16.51,35.56 0 bottom
D2  8.51,51.94 180 bottom
D3  9.14,78.23 180 bottom
EX_IO  69.85,40.64 0 top
FAN  3.81,81.28 270 top
HALL_SENSOR_A1120  97.79,60.96 90 top
I2C  31.75,19.05 0 top
IC1  8.38,75.31 90 top
IC2  87.63,71.12 0 top
IC3  83.82,57.15 0 top
IC4  29.21,40.64 0 top
IC5  21.59,16.51 0 top
IRF7401  9.53,47.5 90 bottom
IRLML2502  8.76,82.17 90 bottom
J_MOTOR_DRIVER_1  -115.57,-1014.73 0 top  (outside the outline)
JP3  38.1,72.39 0 top
JP4  38.1,68.58 0 top
LED  97.79,80.01 90 top
MICRO_USB_B  48.26,40.64 0 top
MOTOR_LEFT  83.82,40.64 0 top
MOTOR_RIGHT  82.55,81.28 180 top
ONE_WIRE  60.96,40.64 0 top
PCA9306  35.56,48.26 270 bottom
PI_HEADER  49.53,80.01 0 top
Q2  73.66,63.5 0 top
Q4  71.12,69.85 0 top
Q5  27.94,7.62 0 top
Q6  92.71,60.96 0 top
Q7  66.04,72.39 0 top
Q8  86.36,45.72 180 top
Q9  58.42,67.31 90 bottom
R1  5.08,15.24 0 top
R2  3.81,10.16 0 top
R5  60.96,11.43 0 top
R6  66.04,11.43 0 top
R7  7.62,7.62 0 top
R8  63.5,16.51 0 top
R9  13.97,27.94 0 top
R10  13.97,22.86 0 top
R11  13.97,10.16 0 top
R12  69.85,16.51 0 top
R13  55.88,11.43 0 top
R14  79.38,49.78 90 top
R15  80.01,33.02 0 top
R16  80.01,27.94 0 top
R17  17.78,72.39 0 bottom
R18  26.67,72.39 0 bottom
R19  35.56,34.29 0 top
R20  35.56,29.21 0 top
R21  11.43,82.17 90 bottom
R22  55.37,72.64 0 top
R23  41.91,29.21 0 top
R24  41.91,24.13 0 top
R25  6.73,71.37 0 bottom
R26  6.73,69.34 0 bottom
R27  94.36,80.01 0 bottom
R28  94.36,82.04 0 bottom
R29  63.5,24.13 0 top
R30  74.93,52.07 0 top
R31  76.2,38.1 0 top
R32  74.93,17.78 0 top
R33  35.56,12.7 0 top
R35  4.57,52.2 0 bottom
RGB_LED  3.81,72.39 270 top
SJ2  60.96,53.34 0 top
SJ3  36.83,24.13 0 top
SJ4  36.83,17.78 0 top
SJ5  76.2,12.7 0 top
SUPPLY_IN  3.81,48.26 270 top
TFMINI  97.79,71.12 90 top
U1  53.34,52.07 0 bottom
U2  26.67,72.39 0 top
U3  68.58,54.61 0 top
U4  17.78,72.39 0 top
U5  66.04,59.69 0 top
U$1  49.53,66.04 0 bottom
U$2  46.99,57.15 0 bottom
U$3  43.18,52.07 0 bottom
U$10  17.14,50.55 90 top

### Tracks (layer width: path | path; a pad name or v marks a point on that pad's centre or on a via)
+3V3  (45 unrouted)
+5V  (29 unrouted)
+8V  (11 unrouted)
ANALOG_3V3  (1 unrouted)
BOOT0  (3 unrouted)
BOOT1  (3 unrouted)
CONV_5V  (2 unrouted)
GND  (126 unrouted)
M_DIR_1  (3 unrouted)
M_DIR_2  (1 unrouted)
N$1  (3 unrouted)
N$2  (1 unrouted)
N$3  (1 unrouted)
N$4  (1 unrouted)
N$5  (3 unrouted)
N$6  (3 unrouted)
N$7  (3 unrouted)
N$8  (3 unrouted)
N$9  (3 unrouted)
N$10  (1 unrouted)
N$11  (1 unrouted)
N$12  (1 unrouted)
N$13  (1 unrouted)
N$14  (1 unrouted)
N$15  (1 unrouted)
N$16  (1 unrouted)
N$17  (2 unrouted)
N$18  (2 unrouted)
N$19  (1 unrouted)
N$20  (2 unrouted)
N$21  (2 unrouted)
N$23  (2 unrouted)
N$24  (2 unrouted)
N$25  (2 unrouted)
N$26  (2 unrouted)
N$27  (1 unrouted)
N$28  (2 unrouted)
N$29  (2 unrouted)
N$30  (1 unrouted)
N$31  (1 unrouted)
N$32  (1 unrouted)
N$33  (1 unrouted)
N$34  (1 unrouted)
N$35  (1 unrouted)
N$36  (1 unrouted)
N$37  (1 unrouted)
N$38  (5 unrouted)
N$39  (2 unrouted)
N$40  (2 unrouted)
N$41  (1 unrouted)
N$42  (1 unrouted)
N$43  (1 unrouted)
N$44  (1 unrouted)
N$45  (1 unrouted)
N$46  (1 unrouted)
N$47  (1 unrouted)
N$48  (1 unrouted)
N$49  (1 unrouted)
N$50  (1 unrouted)
N$51  (1 unrouted)
N$55  (3 unrouted)
N$56  (1 unrouted)
  Bottom 1.27: R35.1 6.3,52.2 D2.C
N$60  (1 unrouted)
  Bottom 1.27: 4.32,46.61 5.33,45.59 IRF7401.1 IRF7401.2 IRF7401.3
NRST  (1 unrouted)
PIN_OUT  (1 unrouted)
PWM_M_EN_1  (1 unrouted)
PWM_M_EN_2  (1 unrouted)
SCL  (9 unrouted)
SDA  (9 unrouted)
SWDIO  (1 unrouted)
TEMPERATURE  (2 unrouted)
USART1_RX  (1 unrouted)
USART1_TX  (1 unrouted)
USART2_RX  (1 unrouted)
USART2_TX  (1 unrouted)
USB_DM  (1 unrouted)
USB_DP  (1 unrouted)
V+  (5 unrouted)
  Top 1.27: C27.+ 4.48,50.63 SUPPLY_IN.2
  Bottom 1.27: R35.2 3.72,50.89 4.19,50.42 | C16.1 3.26,48.98 3.81,49.53